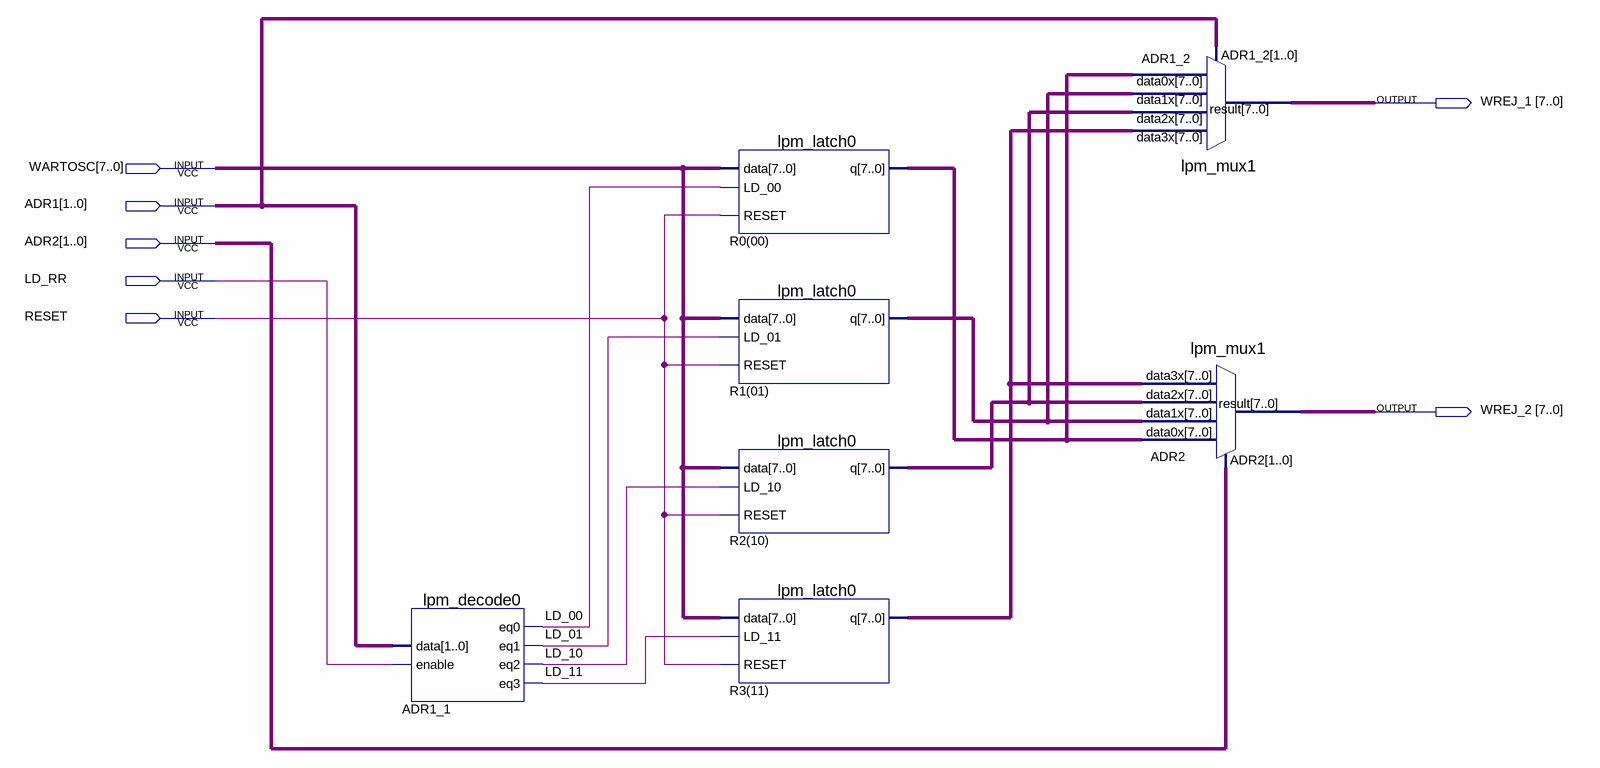
[diagram p0: schematic sheet]
// Quartus schematic Bank_rejestrów.bdf as structural Verilog: 7 symbols, 7 pins
module \Bank_rejestrów  (
  input  [7:0] WARTOSC,
  input  [1:0] ADR1,
  input  [1:0] ADR2,
  input  LD_RR,
  input  RESET,
  output [7:0] WREJ_1,
  output [7:0] WREJ_2
);

  wire LD_00, LD_01, LD_10, LD_11;
  wire [7:0] R0_00__q, R1_01__q, R2_10__q, R3_11__q;

  lpm_decode0 ADR1_1 (.data(ADR1), .enable(LD_RR), .eq0(LD_00), .eq1(LD_01), .eq2(LD_10), .eq3(LD_11));
  lpm_latch0 \R0(00)  (.data(WARTOSC), .RESET(RESET), .LD_00(LD_00), .q(R0_00__q));
  lpm_latch0 \R1(01)  (.data(WARTOSC), .RESET(RESET), .LD_01(LD_01), .q(R1_01__q));
  lpm_latch0 \R2(10)  (.data(WARTOSC), .RESET(RESET), .LD_10(LD_10), .q(R2_10__q));
  lpm_latch0 \R3(11)  (.data(WARTOSC), .RESET(RESET), .LD_11(LD_11), .q(R3_11__q));
  lpm_mux1 ADR1_2 (
    .data3x(R3_11__q), .data2x(R2_10__q), .data1x(R1_01__q), .data0x(R0_00__q), .ADR1_2(ADR1), .result(WREJ_1));
  lpm_mux1 u_ADR2 (
    .data3x(R3_11__q), .data2x(R2_10__q), .data1x(R1_01__q), .data0x(R0_00__q), .ADR2(ADR2), .result(WREJ_2));
endmodule
